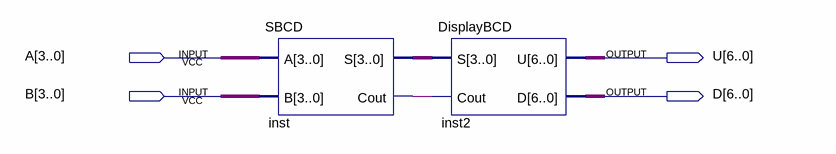
[diagram p0: schematic sheet]
// Quartus schematic BCD.bdf as structural Verilog: 2 symbols, 4 pins
module BCD (
  input  [3:0] A,
  input  [3:0] B,
  output [6:0] U,
  output [6:0] D
);

  wire inst_cout;
  wire [3:0] inst_s;

  SBCD inst (.A(A), .B(B), .S(inst_s), .Cout(inst_cout));
  DisplayBCD inst2 (.S(inst_s), .Cout(inst_cout), .U(U), .D(D));
endmodule
